# Altium project Ngu nghiep.PrjPCB
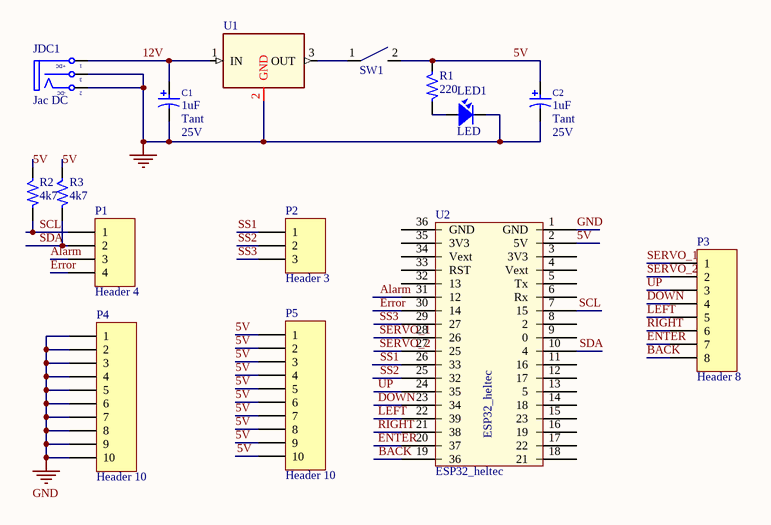
[diagram p0: Ngu nghiep.SchDoc]
2 sheets, 38 parts. Net scope: global (net labels, ports and power ports of the same name join across sheets).
Sheets:
  Ngu nghiep.SchDoc
  phim_led.SchDoc

## Sheet Ngu nghiep.SchDoc
size A

### Parts
C1  Capacitor Type: Tant  Volt: 25V  [RADIAL B]  (hidden comment: 1uF)
C2  Capacitor Type: Tant  Volt: 25V  [RADIAL B]  (hidden comment: 1uF)
JDC1  Jac DC  [DC0]
LED1  LED  [LED-5-RED]
P1  Header 4  [HDR1X4]
P2  Header 3  [HDR1X3]
P3  Header 8  [HDR1X8]
P4  Header 10  [HDR1X10]
P5  Header 10  [HDR1X10]
R1  220  [RES-1/4W]
R2  4k7  [RES-1/4W]
R3  4k7  [RES-1/4W]
SW1  SW 2_BAP BENH_MH  [SW2_ BAP BENH]  (value not drawn)
U1  LM78xx  [TO-220]  (value not drawn)
U2  ESP32_heltec  [ESP32_WFK_Heltec]

### Nets
GND: C1.2 C2.2 JDC1.2(TN) JDC1.3(S) LED1.2 P4.1 P4.2 P4.3 P4.4 P4.5 P4.6 P4.7 P4.8 P4.9 P4.10 U1.2(GND) U2.1(GND)
5V: C2.1 P5.1 P5.2 P5.3 P5.4 P5.5 P5.6 P5.7 P5.8 P5.9 P5.10 R1.1 R2.1 R3.1 SW1.2 U2.2(5V)
12V: C1.1 JDC1.1(T) U1.1(IN)
Alarm: P1.3 U2.31(12)
BACK: P3.8 U2.19(36)
DOWN: P3.4 U2.23(34)
ENTER: P3.7 U2.20(37)
Error: P1.4 U2.30(14)
LEFT: P3.5 U2.22(39)
RIGHT: P3.6 U2.21(38)
SCL: P1.1 R2.2 U2.7(15)
SDA: P1.2 R3.2 U2.10(4)
SERVO_1: P3.1 U2.28(26)
SERVO_2: P3.2 U2.27(25)
SS1: P2.1 U2.26(33)
SS2: P2.2 U2.25(32)
SS3: P2.3 U2.29(27)
UP: P3.3 U2.24(35)
NetLED1_1: LED1.1 R1.2
NetSW1_1: SW1.1 U1.3(OUT)

Not connected (* = marked no-connect by the designer): U2 3(3V3) 4(Vext) 5(Tx) 6(Rx) 8(2) 9(0) 11(16) 12(17) 13(5) 14(18) 15(23) 16(19) 17(22) 18(21) 32(13) 33(RST) 34(Vext) 35(3V3) 36(GND)

### Notes on the sheet
- (in symbol DCIN) +DC; -DC

### Library data of the parts
C1 C2 = Cap_Pol: Polarized Capacitor; Manufacturer: FARNELL; AEMS Code: 2100110; Vendor: Digikey; Publisher: Hoang Nguyen; Value: 1uF; Published: 13-April-2009; ComponentLink1Description: Digikey Part Link; ComponentLink2Description: Open Datasheet; ComponentLink2URL: H:\LIBRARY\LIBRARY.Datasheet\
JDC1 = DCIN: Jac DC input; Value: Jac DC
LED1 = LED: LED Single colour Green and Red; Value: LED 3 ly Single Colour
P1 = Header 4: Header, 4-Pin; LatestRevisionDate: 17-Jul-2002; LatestRevisionNote: Re-released for DXP Platform.; Publisher: Altium Limited
P2 = Header 3: Header, 3-Pin; LatestRevisionDate: 17-Jul-2002; LatestRevisionNote: Re-released for DXP Platform.; Publisher: Altium Limited
P3 = Header 8: Header, 8-Pin; LatestRevisionDate: 17-Jul-2002; LatestRevisionNote: Re-released for DXP Platform.; Publisher: Altium Limited
P4 P5 = Header 10: Header, 10-Pin; LatestRevisionDate: 17-Jul-2002; LatestRevisionNote: Re-released for DXP Platform.; Publisher: Altium Limited
R1-R3 = R: Resistor 1/4W; Value: R1/4W - 1K
SW1 = SW 2_BAP BENH_MH: Công tắc bập bênh 2 chân MH001568
U1 = 78xx: Regulator; Manufacturer: Fairchild Semiconductor Corporation; PSpiceTemplate: X^@REFDES %IN %OUT %GND @MODEL; Vendor: Digikey; Output Current: Up to 1A; V out: 5V; Tolerance: 4 %; Value: LM7805CT; Published: 13-April-2009; Publisher: Hoang Nguyen; ComponentLink1Description: Digikey Part Link; ComponentLink2Description: Open Datasheet; ComponentLink2URL: H:\LIBRARY\LIBRARY.Datasheet\LM7805.pdf; Price: 2500 VND
U2 = ESP32_heltec: ESP32 IOT kit

## Sheet phim_led.SchDoc
size A
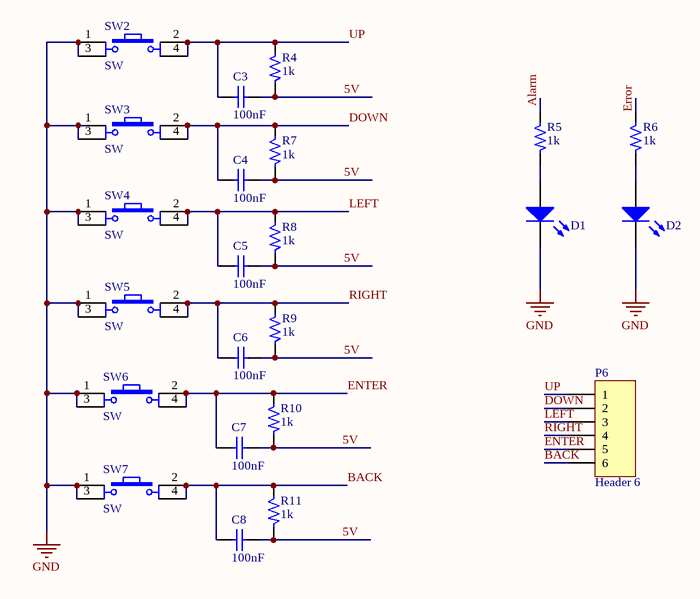
[diagram p1: phim_led.SchDoc]

### Parts
C3  value 100nF  [Tu-pico]  (hidden comment: Capacitor Ceramic)
C4  value 100nF  [Tu-pico]  (hidden comment: Capacitor Ceramic)
C5  value 100nF  [Tu-pico]  (hidden comment: Capacitor Ceramic)
C6  value 100nF  [Tu-pico]  (hidden comment: Capacitor Ceramic)
C7  value 100nF  [Tu-pico]  (hidden comment: Capacitor Ceramic)
C8  value 100nF  [Tu-pico]  (hidden comment: Capacitor Ceramic)
D1  LED  [LED_3mm]  (value not drawn)
D2  LED  [LED_3mm]  (value not drawn)
P6  Header 6  [HDR1X6]
R4  1k  [RES-1/4W]
R5  1k  [RES-1/4W]
R6  1k  [RES-1/4W]
R7  1k  [RES-1/4W]
R8  1k  [RES-1/4W]
R9  1k  [RES-1/4W]
R10  1k  [RES-1/4W]
R11  1k  [RES-1/4W]
SW2  SW  [SW4]
SW3  SW  [SW4]
SW4  SW  [SW4]
SW5  SW  [SW4]
SW6  SW  [SW4]
SW7  SW  [SW4]

### Nets
GND: D1.2(K) D2.2(K) SW2.1 SW2.3 SW3.1 SW3.3 SW4.1 SW4.3 SW5.1 SW5.3 SW6.1 SW6.3 SW7.1 SW7.3
5V: C3.2 C4.2 C5.2 C6.2 C7.2 C8.2 R4.2 R7.2 R8.2 R9.2 R10.2 R11.2
Alarm: R5.1
BACK: C8.1 P6.6 R11.1 SW7.2 SW7.4
DOWN: C4.1 P6.2 R7.1 SW3.2 SW3.4
ENTER: C7.1 P6.5 R10.1 SW6.2 SW6.4
Error: R6.1
LEFT: C5.1 P6.3 R8.1 SW4.2 SW4.4
RIGHT: C6.1 P6.4 R9.1 SW5.2 SW5.4
UP: C3.1 P6.1 R4.1 SW2.2 SW2.4
NetD1_1: D1.1(A) R5.2
NetD2_1: D2.1(A) R6.2

### Library data of the parts
C3-C8 = CapCeramic: Capacitor; Published: 8-Jun-2000; LatestRevisionDate: 17-Jul-2002; LatestRevisionNote: Re-released for DXP Platform.; PackageReference: RAD-0.3; Publisher: Altium Limited
D1 D2 = LED: Typical INFRARED GaAs LED; Published: 8-Jun-2000; LatestRevisionDate: 08-Jul-2005; LatestRevisionNote: Mech Layer 1 removed.; PackageReference: LED-0; Publisher: Altium Limited
P6 = Header 6: Header, 6-Pin; LatestRevisionDate: 17-Jul-2002; LatestRevisionNote: Re-released for DXP Platform.; Publisher: Altium Limited
R4-R11 = R: Resistor 1/4W; Value: R1/4W - 1K
SW2-SW7 = SW4: Switch button 4 pin; Value: Button chip 4 pin

## Nets that join several sheets
GND: Ngu nghiep (17 pins), phim_led (14 pins)
5V: Ngu nghiep (16 pins), phim_led (12 pins)
Alarm: Ngu nghiep (P1.3 U2.31), phim_led (R5.1)
BACK: Ngu nghiep (P3.8 U2.19), phim_led (5 pins)
DOWN: Ngu nghiep (P3.4 U2.23), phim_led (5 pins)
ENTER: Ngu nghiep (P3.7 U2.20), phim_led (5 pins)
Error: Ngu nghiep (P1.4 U2.30), phim_led (R6.1)
LEFT: Ngu nghiep (P3.5 U2.22), phim_led (5 pins)
RIGHT: Ngu nghiep (P3.6 U2.21), phim_led (5 pins)
UP: Ngu nghiep (P3.3 U2.24), phim_led (5 pins)